# Altium project PM_Adapter_v2.PrjPcb
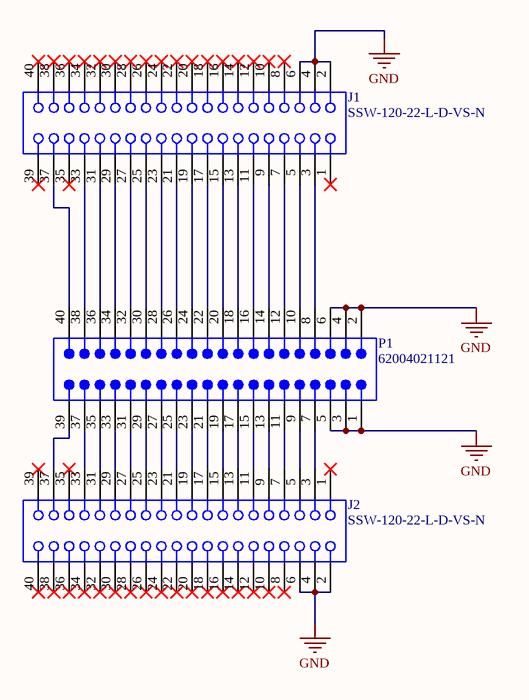
[diagram p0: Sheet2.SchDoc]
1 sheet, 3 parts. Net scope: global (net labels, ports and power ports of the same name join across sheets).
Board file: PCB2.PcbDoc

## Sheet Sheet2.SchDoc
size A4; SheetNumber: 1; SheetTotal: 1

### Parts
J1  SSW-120-22-L-D-VS-N  [SMTC-SSW-120-22-X-D-VS-N]
J2  SSW-120-22-L-D-VS-N  [SMTC-SSW-120-22-X-D-VS-N]
P1  62004021121  [62004021121]

### Nets
GND: J1.2 J1.4 J1.6 J2.2 J2.4 J2.6 P1.1 P1.2 P1.3 P1.4 P1.5 P1.6
NetJ1_3: J1.3 P1.8
NetJ1_5: J1.5 P1.10
NetJ1_7: J1.7 P1.12
NetJ1_9: J1.9 P1.14
NetJ1_11: J1.11 P1.16
NetJ1_13: J1.13 P1.18
NetJ1_15: J1.15 P1.20
NetJ1_17: J1.17 P1.22
NetJ1_19: J1.19 P1.24
NetJ1_21: J1.21 P1.26
NetJ1_23: J1.23 P1.28
NetJ1_25: J1.25 P1.30
NetJ1_27: J1.27 P1.32
NetJ1_29: J1.29 P1.34
NetJ1_31: J1.31 P1.36
NetJ1_33: J1.33 P1.38
NetJ1_37: J1.37 P1.40
NetJ2_3: J2.3 P1.7
NetJ2_5: J2.5 P1.9
NetJ2_7: J2.7 P1.11
NetJ2_9: J2.9 P1.13
NetJ2_11: J2.11 P1.15
NetJ2_13: J2.13 P1.17
NetJ2_15: J2.15 P1.19
NetJ2_17: J2.17 P1.21
NetJ2_19: J2.19 P1.23
NetJ2_21: J2.21 P1.25
NetJ2_23: J2.23 P1.27
NetJ2_25: J2.25 P1.29
NetJ2_27: J2.27 P1.31
NetJ2_29: J2.29 P1.33
NetJ2_31: J2.31 P1.35
NetJ2_33: J2.33 P1.37
NetJ2_37: J2.37 P1.39

Not connected (* = marked no-connect by the designer): J1 1* 8* 10* 12* 14* 16* 18* 20* 22* 24* 26* 28* 30* 32* 34* 35* 36* 38* 39* 40*; J2 1* 8* 10* 12* 14* 16* 18* 20* 22* 24* 26* 28* 30* 32* 34* 35* 36* 38* 39* 40*

### Library data of the parts
J1 J2 = CMP-1023-00465-1: SQ Post Socket, Surface Mount, Vertical, -55 to 125 degC, 2.54 mm Pitch, 40-Pin, Female, RoHS; Manufacturer: Samtec; Pitch: 2.54 mm; PackageReference: SSW-120-22-X-D-VS-N; ComponentLink3URL: http://www.samtec.com/documents/webfiles/cpdf/SSW-1XX-22-XXX-X-XX-XX-X-XX-MKT.pdf; ComponentLink3Description: Package Specification; ComponentLink1URL: http://www.samtec.com; ComponentLink2URL: http://www.samtec.com/documents/webfiles/pdf/SSW_SM.PDF; Orientation: Vertical; Temperature Range: -55 to 125 degC; PackageDescription: .100 [2.54] Surface Mount Assembly; PackageVersion: AS, 1/1997; PartNumber: SSW-120-22-L-D-VS-N; Mounting Technology: Surface Mount; ComponentLink1Description: Manufacturer URL; ComponentLink2Description: Datasheet; RoHS: True; DatasheetVersion: F-214
P1 = CMP-03913-29930342-2: 62004021121 Conn, Header, 40Pos, 2Row, 2Mm Rohs Compliant: Yes; Operating Supply Voltage: 200V; Contact Resistance: 20mΩ; Current Rating: 2A; Gender: Male; Orientation: Vertical; NexarPartId: 29930342; Lead Pitch: 2mm; Number of Pins: 40